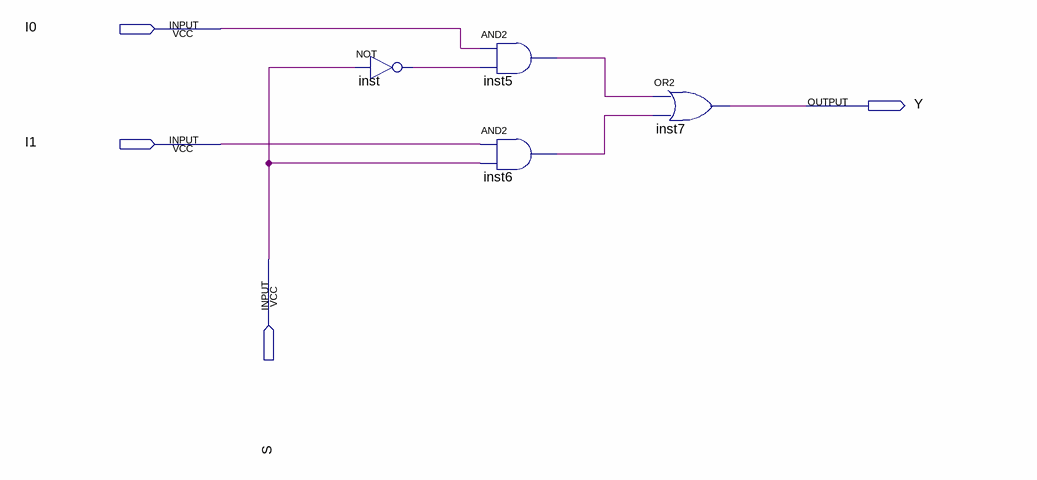
[diagram p0: schematic sheet]
// Quartus schematic Mux2_1.bdf as structural Verilog: 4 symbols, 4 pins
module Mux2_1 (
  input  I0,
  input  I1,
  input  S,
  output Y
);

  wire inst5_out, inst6_out, inst_out;

  not inst (inst_out, S);
  and inst5 (inst5_out, I0, inst_out);
  and inst6 (inst6_out, I1, S);
  or inst7 (Y, inst5_out, inst6_out);
endmodule
